# EAGLE design 8eye line sensor (EAGLE 7.1.0)
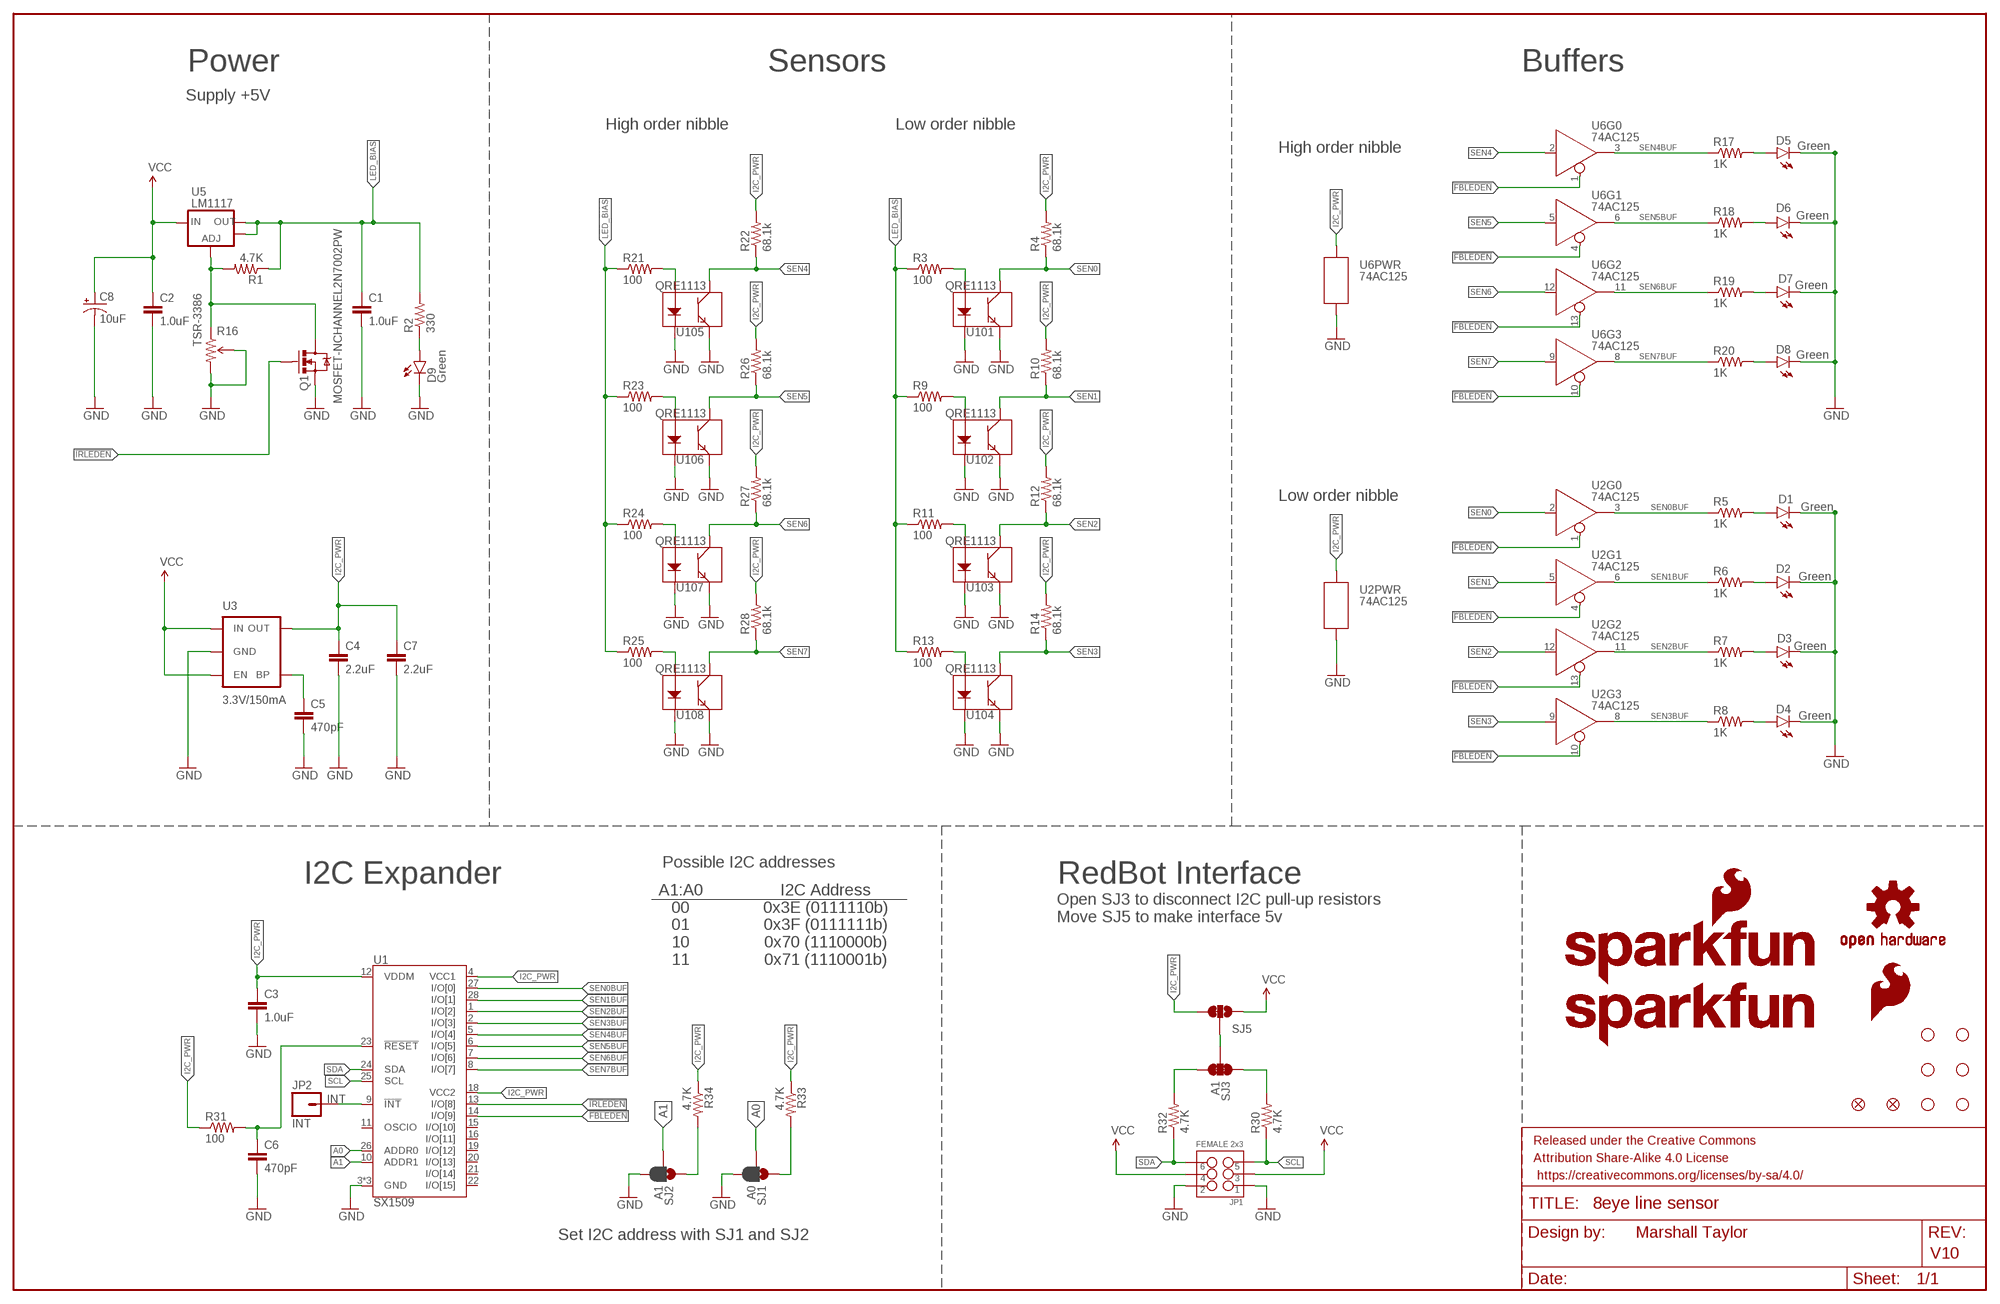
[diagram p0: schematic, sheet 1]

## Parts
C1  1.0uF  1.0UF-16V-10%(0603)  [0603-CAP]
C2  1.0uF  1.0UF-16V-10%(0603)  [0603-CAP]
C3  1.0uF  1.0UF-16V-10%(0603)  [0603-CAP]
C4  2.2uF  2.2UF-10V-20%(0603)  [0603-CAP]
C5  470pF  470PF-50V-5%(0603)SMD  [0603-CAP]
C6  470pF  470PF-50V-5%(0603)SMD  [0603-CAP]
C7  2.2uF  2.2UF-10V-20%(0603)  [0603-CAP]
C8  10uF  10UF-16V-10%(TANT)  [EIA3216]
D1  Green  LED-GREEN1206-BOTTOM  [LED-1206-BOTTOM]
D2  Green  LED-GREEN1206-BOTTOM  [LED-1206-BOTTOM]
D3  Green  LED-GREEN1206-BOTTOM  [LED-1206-BOTTOM]
D4  Green  LED-GREEN1206-BOTTOM  [LED-1206-BOTTOM]
D5  Green  LED-GREEN1206-BOTTOM  [LED-1206-BOTTOM]
D6  Green  LED-GREEN1206-BOTTOM  [LED-1206-BOTTOM]
D7  Green  LED-GREEN1206-BOTTOM  [LED-1206-BOTTOM]
D8  Green  LED-GREEN1206-BOTTOM  [LED-1206-BOTTOM]
D9  Green  LED-GREEN1206-BOTTOM  [LED-1206-BOTTOM]
FID1  FIDUCIALUFIDUCIAL  [MICRO-FIDUCIAL]
FID2  FIDUCIALUFIDUCIAL  [MICRO-FIDUCIAL]
FRAME2  FRAME-LEDGER  [CREATIVE_COMMONS]
JP1  FEMALE 2x3  M03X2FEMALE  [2X3]
JP2  INT  M01PTH  [1X01]
LOGO1  SFE_LOGO_NAME_FLAME.2_INCH  [SFE_LOGO_NAME_FLAME_.2]
LOGO2  SFE_LOGO_NAME.2_INCH  [SFE_LOGO_NAME_.2]
LOGO5  SFE_LOGO_FLAME.3_INCH  [SFE_LOGO_FLAME_.3]
LOGO6  OSHW-LOGOS  [OSHW-LOGO-S]
Q1  MOSFET-NCHANNEL2N7002PW  [SOT323]
R1  4.7K  4.7KOHM-1/10W-1%(0603)  [0603-RES]
R2  330  330OHM1/10W1%(0603)  [0603-RES]
R3  100  100OHM-1/10W-1%(0603)  [0603-RES]
R4  68.1k  68.1KOHM1/10W1%(0603)  [0603-RES]
R5  1K  1KOHM-1/10W-1%(0603)  [0603-RES]
R6  1K  1KOHM-1/10W-1%(0603)  [0603-RES]
R7  1K  1KOHM-1/10W-1%(0603)  [0603-RES]
R8  1K  1KOHM-1/10W-1%(0603)  [0603-RES]
R9  100  100OHM-1/10W-1%(0603)  [0603-RES]
R10  68.1k  68.1KOHM1/10W1%(0603)  [0603-RES]
R11  100  100OHM-1/10W-1%(0603)  [0603-RES]
R12  68.1k  68.1KOHM1/10W1%(0603)  [0603-RES]
R13  100  100OHM-1/10W-1%(0603)  [0603-RES]
R14  68.1k  68.1KOHM1/10W1%(0603)  [0603-RES]
R16  TSR-3386  TRIMPOT-PTH-KNOB  [3386U]
R17  1K  1KOHM-1/10W-1%(0603)  [0603-RES]
R18  1K  1KOHM-1/10W-1%(0603)  [0603-RES]
R19  1K  1KOHM-1/10W-1%(0603)  [0603-RES]
R20  1K  1KOHM-1/10W-1%(0603)  [0603-RES]
R21  100  100OHM-1/10W-1%(0603)  [0603-RES]
R22  68.1k  68.1KOHM1/10W1%(0603)  [0603-RES]
R23  100  100OHM-1/10W-1%(0603)  [0603-RES]
R24  100  100OHM-1/10W-1%(0603)  [0603-RES]
R25  100  100OHM-1/10W-1%(0603)  [0603-RES]
R26  68.1k  68.1KOHM1/10W1%(0603)  [0603-RES]
R27  68.1k  68.1KOHM1/10W1%(0603)  [0603-RES]
R28  68.1k  68.1KOHM1/10W1%(0603)  [0603-RES]
R30  4.7K  4.7KOHM-1/10W-1%(0603)  [0603-RES]
R31  100  100OHM-1/10W-1%(0603)  [0603-RES]
R32  4.7K  4.7KOHM-1/10W-1%(0603)  [0603-RES]
R33  4.7K  4.7KOHM-1/10W-1%(0603)  [0603-RES]
R34  4.7K  4.7KOHM-1/10W-1%(0603)  [0603-RES]
SJ1  A0  JUMPER-PAD-3-2OF3_NC_BY_PASTE  [PAD-JUMPER-3-2OF3_NC_BY_PASTE_YES_SILK_FULL_BOX]
SJ2  A1  JUMPER-PAD-3-2OF3_NC_BY_PASTE  [PAD-JUMPER-3-2OF3_NC_BY_PASTE_YES_SILK_FULL_BOX]
SJ3  A1  JUMPER-PAD-3-NC_BY_TRACE  [PAD-JUMPER-3-3OF3_NC_BY_TRACE_YES_SILK_FULL_BOX]
SJ5  JUMPER-PAD-3-2OF3_NC_BY_TRACE_SMALL  [PAD-JUMPER-3-2OF3_NC_BY_TRACE_YES_SILK_FULL_BOX]
STANDOFF1  STAND-OFF  [STAND-OFF]
STANDOFF2  STAND-OFF  [STAND-OFF]
STANDOFF3  STAND-OFF  [STAND-OFF]
STANDOFF4  STAND-OFF  [STAND-OFF]
STANDOFF5  STAND-OFF  [STAND-OFF]
STANDOFF6  STAND-OFF  [STAND-OFF]
U1  SX1509  [QFN-28]
U2  74AC125  74AC125DG125  [SO14]
U3  3.3V/150mA  V_REG_MIC52053.3V  [SOT23-5]
U5  LM1117  V_REG_LM1117SOT223  [SOT223]
U6  74AC125  74AC125DG125  [SO14]
U101  QRE1113  [QRE1113]
U102  QRE1113  [QRE1113]
U103  QRE1113  [QRE1113]
U104  QRE1113  [QRE1113]
U105  QRE1113  [QRE1113]
U106  QRE1113  [QRE1113]
U107  QRE1113  [QRE1113]
U108  QRE1113  [QRE1113]

## Nets
!FBLEDEN: U1.14(I/O[9]) U2.1(!EN) U2.4(!EN) U2.10(!EN) U2.13(!EN) U6.1(!EN) U6.4(!EN) U6.10(!EN) U6.13(!EN)
!IRLEDEN: Q1.1(G) U1.13(I/O[8])
A0: SJ1.2 U1.26(ADDR0)
A1: SJ2.2 U1.10(ADDR1)
GND: C1.2 C2.2 C3.2 C4.2 C5.2 C6.2 C7.2 C8.C(-) D1.C D2.C D3.C D4.C D5.C D6.C D7.C D8.C D9.C JP1.1 JP1.2 Q1.2(S) R16.2(WIPER) R16.3(CW) SJ1.3 SJ2.3 U1.3(GND) U1.17(GND) U1.29(GND) U2.7(PWR:P$V-) U3.2(GND) U6.7(PWR:P$V-) U101.2(K) U101.4(E) U102.2(K) U102.4(E) U103.2(K) U103.4(E) U104.2(K) U104.4(E) U105.2(K) U105.4(E) U106.2(K) U106.4(E) U107.2(K) U107.4(E) U108.2(K) U108.4(E)
I2C_PWR: C3.1 C4.1 C7.1 R4.2 R10.2 R12.2 R14.2 R22.2 R26.2 R27.2 R28.2 R31.1 R33.1 R34.1 SJ5.3 U1.4(VCC1) U1.12(VDDM) U1.18(VCC2) U2.14(PWR:P$V+) U3.5(OUT) U6.14(PWR:P$V+)
INT: JP2.1 U1.9(!INT)
LED_BIAS: C1.1 R1.1 R2.2 R3.1 R9.1 R11.1 R13.1 R21.1 R23.1 R24.1 R25.1 U5.2(OUT) U5.4(OUT)
N$1: Q1.3(D) R1.2 R16.1(CCW) U5.1(ADJ)
N$2: R3.2 U101.1(A)
N$3: R21.2 U105.1(A)
N$4: R30.2 SJ3.1
N$5: D1.A R5.2
N$6: C5.1 U3.4(BP)
N$7: D2.A R6.2
N$8: R32.2 SJ3.3
N$9: D3.A R7.2
N$10: R34.2 SJ2.1
N$11: D4.A R8.2
N$12: R9.2 U102.1(A)
N$13: R23.2 U106.1(A)
N$14: R11.2 U103.1(A)
N$15: R24.2 U107.1(A)
N$16: R13.2 U104.1(A)
N$17: R25.2 U108.1(A)
N$18: D9.A R2.1
N$19: SJ3.2 SJ5.2
N$20: D5.A R17.2
N$21: R33.2 SJ1.1
N$22: D6.A R18.2
N$24: D7.A R19.2
N$26: D8.A R20.2
SCL: JP1.5 R30.1 U1.25(SCL)
SDA: JP1.6 R32.1 U1.24(SDA)
SEN0: R4.1 U2.2(D) U101.3(C)
SEN0BUF: R5.1 U1.27(I/O[0]) U2.3(Q)
SEN1: R10.1 U2.5(D) U102.3(C)
SEN1BUF: R6.1 U1.28(I/O[1]) U2.6(Q)
SEN2: R12.1 U2.12(D) U103.3(C)
SEN2BUF: R7.1 U1.1(I/O[2]) U2.11(Q)
SEN3: R14.1 U2.9(D) U104.3(C)
SEN3BUF: R8.1 U1.2(I/O[3]) U2.8(Q)
SEN4: R22.1 U6.2(D) U105.3(C)
SEN4BUF: R17.1 U1.5(I/O[4]) U6.3(Q)
SEN5: R26.1 U6.5(D) U106.3(C)
SEN5BUF: R18.1 U1.6(I/O[5]) U6.6(Q)
SEN6: R27.1 U6.12(D) U107.3(C)
SEN6BUF: R19.1 U1.7(I/O[6]) U6.11(Q)
SEN7: R28.1 U6.9(D) U108.3(C)
SEN7BUF: R20.1 U1.8(I/O[7]) U6.8(Q)
VCC: C2.1 C8.A(+) JP1.3 JP1.4 SJ5.1 U3.1(IN) U3.3(EN) U5.3(IN)
~RESET: C6.1 R31.2 U1.23(!RESET)
Unconnected: U1.11(OSCIO) U1.15(I/O[10]) U1.16(I/O[11]) U1.19(I/O[12]) U1.20(I/O[13]) U1.21(I/O[14]) U1.22(I/O[15])

## Notes on the sheet
- Power | Sensors | Buffers
- Supply +5V
- High order nibble | Low order nibble
- High order nibble
- Low order nibble
- Possible I2C addresses
- I2C Expander
- A1:A0
  00
  01
  10
  11
- I2C Address
  0x3E (0111110b)
  0x3F (0111111b)
  0x70 (1110000b)
  0x71 (1110001b)
- RedBot Interface
- Open SJ3 to disconnect I2C pull-up resistors
  Move SJ5 to make interface 5v
- Set I2C address with SJ1 and SJ2 | Marshall Taylor
- V10

## Library data of the parts
C1-C3 = SparkFun-Capacitors:1.0UF-16V-10%(0603): CAP-00868; PROD_ID: CAP-00868
C4 C7 = SparkFun-Capacitors:2.2UF-10V-20%(0603): CAP-07888; PROD_ID: CAP-07888
C5 C6 = SparkFun-Capacitors:470PF-50V-5%(0603): CAP-07884; PROD_ID: CAP-07884
C8 = SparkFun-Capacitors:10UF-16V-10%(TANT): CAP-00811 1206/EIA-3216 Tantalum capacitor; PROD_ID: CAP-00811
D1-D9 = SparkFun-LED:LED-GREEN: Various green LEDs Green LEDs used in SFE Production 0603- DIO-00821 LARGE- DIO-00862 LILYPAD- DIO-09910; PROD_ID: DIO-11076
FID1 FID2 = SparkFun-Aesthetics:FIDUCIAL: Fiducial Alignment Points Various fiducial points for machine vision alignment.
FRAME2 = SparkFun-Aesthetics:FRAME-LEDGER: Schematic Frame Standard 11x14 US Ledger frame
JP1 = SparkFun-Connectors:M03X2: 2x3 .1" header. Shrouded, with keying- CONN-10681 SMT- CONN-11415 Pogo pins- HW-11044; PROD_ID: CONN-11566
JP2 = SparkFun-Connectors:M01: Header 1 Standard 1-pin 0.1" header. Use with straight break away headers (SKU : PRT-00116), right angle break away headers (PRT-00553), swiss pins (PRT-00743), machine pins (PRT-00117), and female headers (PRT-00115).
LOGO1 = SparkFun-Aesthetics:SFE_LOGO_NAME_FLAME: SFE Logo, name and flame This is the SparkFun full logo. The logo on the schematic will always be the same size; the package variant is the height of the flame part of the logo. Default layer for the logo on the board is tSilk.
LOGO2 = SparkFun-Aesthetics:SFE_LOGO_NAME: SFE Logo, name only This is the SparkFun name logo. The logo on the schematic will always be the same size; the package variant is the height of the flame part of the logo (or the height the flame would be, if it were drawn). Default layer for the logo on the board is tSilk.
LOGO5 = SparkFun-Aesthetics:SFE_LOGO_FLAME: SFE Logo, flame only This is the SparkFun flame logo. The logo on the schematic will always be the same size; the package variant is the height of the flame. Default layer for the logo on the board is tSilk.
LOGO6 = SparkFun-Aesthetics:OSHW-LOGO: Open Source Hardware Logo This logo indicates the piece of hardware it is found on incorporates a OSHW license and/or adheres to the definition of open source hardware found here: http://freedomdefined.org/OSHW
Q1 = SparkFun-DiscreteSemi:MOSFET-NCHANNEL: Common NMOSFET Parts MFG P/N Store ID Prod ID FDD8780 TRANS-09984 SI7820DN TRANS-11055 FDS6630A IC-08089 2N7002PW TRANS-11151 FQP30N06L COM-10213 TRANS-10060 BSS123LT1G TRANS-08345 BSS138 TRANS-00830 BS170 2N7000; PROD_ID: TRANS-11151
R1 R30 R32-R34 = SparkFun-Resistors:4.7KOHM-1/10W-1%(0603): RES-07857; PROD_ID: RES-07857
R2 = SparkFun-Resistors:330OHM1/10W1%(0603): RES-00818; PROD_ID: RES-00818
R3 R9 R11 R13 R21 R23-R25 R31 = SparkFun-Resistors:100OHM-1/10W-1%(0603): RES-07863; PROD_ID: RES-07863
R4 R10 R12 R14 R22 R26-R28 = SparkFun-Resistors:68.1KOHM1/10W1%(0603): RES-09380; PROD_ID: RES-09380
R5-R8 R17-R20 = SparkFun-Resistors:1KOHM-1/10W-1%(0603): RES-07856; PROD_ID: RES-07856
R16 = SparkFun-Electromechanical:TRIMPOT: Various small potentiometers for "set-and-forget" applications; PROD_ID: RES-09730
SJ1 SJ2 = SparkFun-Passives:JUMPER-PAD-3-2OF3_NC_BY_PASTE
SJ3 = SparkFun-Passives:JUMPER-PAD-3-NC_BY_TRACE
SJ5 = SparkFun-Passives:JUMPER-PAD-3-2OF3_NC_BY_TRACE
STANDOFF1-STANDOFF6 = SparkFun-Electromechanical:STAND-OFF: #4 Stand Off This is the mechanical footprint for a #4 phillips button head screw. Use the keepout ring to avoid running the screw head into surrounding components. SKU : PRT-00447
U1 = SparkFun-DigitalIC:SX1509: Semtech SX1509 The SX1509 is a complete ultra low voltage 1.2V to 3.6V General Purpose parallel Input/Output (GPIO) expanders ideal for low power handheld battery powered equipment. This version comes in a 16-channel configuration and allows easy serial expansion of I/O through a standard 400kHz I2C interface. GPIO devices can provide additional control and monitoring when the microcontroller or chipset has insufficient I/O ports, or in systems where serial communication and control from a remote location is advantageous.; PROD_ID: IC-11311
U2 U6 = SparkFun-DigitalIC:74*125; PROD_ID: IC-08880
U3 = SparkFun-PowerIC:V_REG_MIC5205: V_REG MIC5205 Standard 3.3V, 5V, and Adjustable 150mA LDO voltage regulator in SOT-23 layout. Micrel part MIC5205. BP (by-pass) pin is used to lower output noise with 470pF cap, may be left open. On the adjustable version BP is used to set output.; PROD_ID: VREG-00822
U5 = SparkFun-PowerIC:V_REG_LM1117: Voltage Regulator LM1117 Standard adjustable voltage regulator but in SMD form. Spark Fun Electronics SKU : COM-00595; PROD_ID: VREG-08170
U101-U108 = SparkFun-Sensors:QRE1113: Reflective object sensor; PROD_ID: IC-09357

## Net classes
0 default: clearance 0.305 mm

## Board
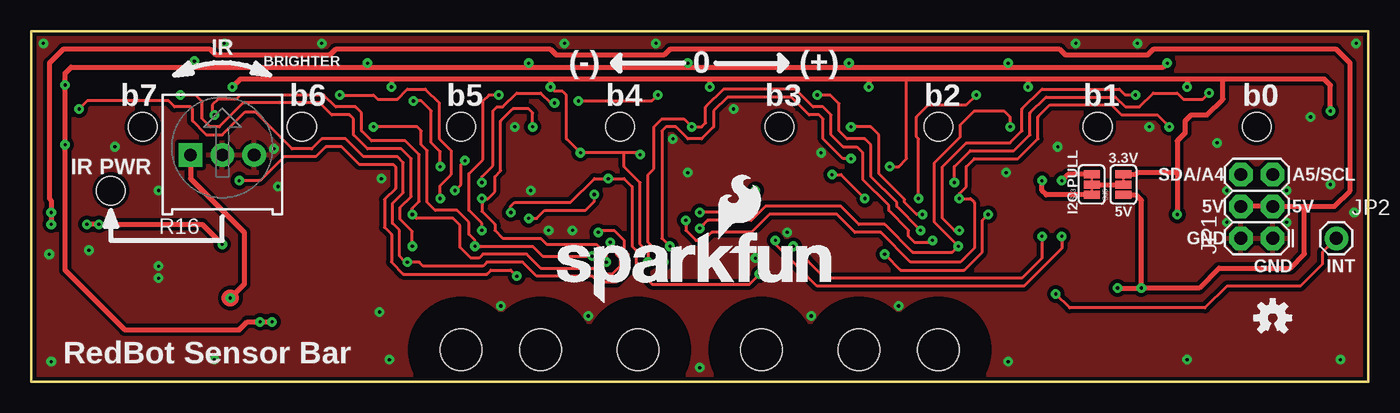
[diagram p1: board, top side]
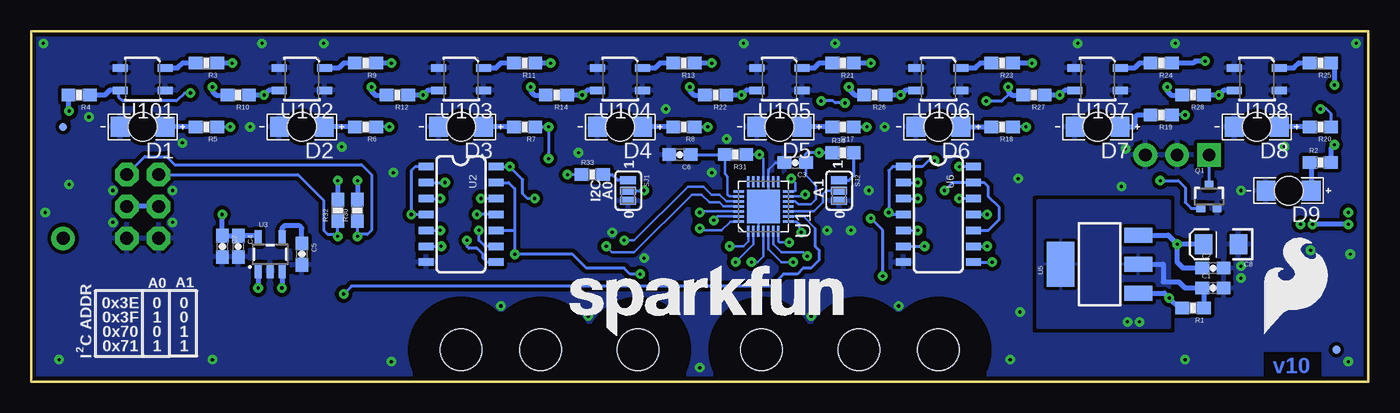
[diagram p2: board, bottom side, seen from below]

Size 106.68 x 27.94 mm. Coordinates in mm from the lower left corner, seen from the top.
Outline: 0,0 106.68,0 106.68,27.94 0,27.94 0,0
Copper layers (1*16): Top 0.035mm / dielectric 1.5mm / Bottom 0.035mm
Design rules "SparkFun-2-layer *": minimum track width 7mil, minimum drill 15mil, track to track 7mil, track to pad 7mil, pad to pad 7mil, via to via 7mil, smd to smd 7mil, copper to edge 8mil, drill to drill 8mil, minimum pad ring 12mil, minimum via ring 10mil, stop-mask expansion 4mil, vias tented up to drill 20mil, thermal gap 10mil
tRestrict: area 68.7,-1.2 to 76.1,6.2; area 62.3,-1.2 to 69.7,6.2; area 54.6,-1.2 to 62,6.2; area 44.7,-1.2 to 52.1,6.2; area 36.9,-1.2 to 44.3,6.2; area 30.6,-1.2 to 38,6.2
bRestrict: area 30.6,-1.2 to 38,6.2; area 36.9,-1.2 to 44.3,6.2; area 44.7,-1.2 to 52.1,6.2; area 54.6,-1.2 to 62,6.2; area 62.3,-1.2 to 69.7,6.2; area 68.7,-1.2 to 76.1,6.2

### Footprints (pad centres in the part's own frame; a part is rotated, then mirrored left to right if it is on the bottom)
0603-CAP = smd 1.1 x 1: 1 -0.85,0; 2 0.85,0
EIA3216 = smd 1.4 x 1.6: A 1.4,0; C -1.4,0
LED-1206-BOTTOM = smd 1.5 x 1.6: A -1.8,0; C 1.8,0 | hole 2.3: 0,0
MICRO-FIDUCIAL = smd 0.635 x 0.635: 1 0,0
2X3 = drill 1.016 pad 1.88 octagon: 1 0,0; 2 0,2.54; 3 2.54,0; 4 2.54,2.54; 5 5.08,0; 6 5.08,2.54
1X01 = drill 1.016 pad 1.88: 1 0,0
SOT323 = smd 0.7 x 0.7: 1 -0.65,-0.925; 2 0.65,-0.925; 3 0,0.925
0603-RES = smd 1.1 x 1: 1 -0.85,0; 2 0.85,0
3386U = drill 1.016 pad 1.88 square: 1 -2.54,-0.015 | drill 1.016 pad 1.88: 2 0,-0.015; 3 2.54,-0.015
PAD-JUMPER-3-2OF3_NC_BY_PASTE_YES_SILK_FULL_BOX = smd 0.635 x 1.27: 1 -0.813,0; 2 0,0; 3 0.813,0
PAD-JUMPER-3-3OF3_NC_BY_TRACE_YES_SILK_FULL_BOX = smd 0.635 x 1.27: 1 -0.813,0; 2 0,0; 3 0.813,0
PAD-JUMPER-3-2OF3_NC_BY_TRACE_YES_SILK_FULL_BOX = smd 0.635 x 1.27: 1 -0.813,0; 2 0,0; 3 0.813,0
STAND-OFF = hole 3.302: 0,0
QFN-28 = smd 0.85 x 0.2: 1 -1.975,1.2; 2 -1.975,0.8; 3 -1.975,0.4; 4 -1.975,0; 5 -1.975,-0.4; 6 -1.975,-0.8; 7 -1.975,-1.2; 15 1.975,-1.2; 16 1.975,-0.8; 17 1.975,-0.4; 18 1.975,0; 19 1.975,0.4; 20 1.975,0.8; 21 1.975,1.2 | smd 0.2 x 0.85: 8 -1.2,-1.975; 9 -0.8,-1.975; 10 -0.4,-1.975; 11 0,-1.975; 12 0.4,-1.975; 13 0.8,-1.975; 14 1.2,-1.975; 22 1.2,1.975; 23 0.8,1.975; 24 0.4,1.975; 25 0,1.975; 26 -0.4,1.975; 27 -0.8,1.975; 28 -1.2,1.975 | smd 2.65 x 2.65: 29 0,0
SO14 = smd 0.6 x 1.2: 1 -3.81,-2.8; 2 -2.54,-2.8; 3 -1.27,-2.8; 4 0,-2.8; 5 1.27,-2.8; 6 2.54,-2.8; 7 3.81,-2.8; 8 3.81,2.8; 9 2.54,2.8; 10 1.27,2.8; 11 0,2.8; 12 -1.27,2.8; 13 -2.54,2.8; 14 -3.81,2.8
SOT23-5 = smd 0.55 x 1.2: 1 -0.95,-1.3; 2 0,-1.3; 3 0.95,-1.3; 4 0.95,1.3; 5 -0.95,1.3
SOT223 = smd 1.219 x 2.235: 1 -2.311,-3.099; 2 0,-3.099; 3 2.311,-3.099 | smd 3.6 x 2.2: 4 0,3.099
QRE1113 = smd 1.2 x 0.6: 1 -1.8,-0.9; 2 1.8,-0.9; 3 1.8,0.9; 4 -1.8,0.9

### Placement (x,y rotation side)
C1  12.38,7.46 0 bottom
C2  12.38,9.05 0 bottom
C3  45.72,17.46 180 bottom
C4  90.17,10.79 270 bottom
C5  85.09,10.16 270 bottom
C6  54.93,18.1 180 bottom
C7  91.44,10.79 270 bottom
C8  11.75,10.95 180 bottom
D1  97.79,20.32 180 bottom
D2  85.09,20.32 180 bottom
D3  72.39,20.32 180 bottom
D4  59.69,20.32 180 bottom
D5  46.99,20.32 180 bottom
D6  34.29,20.32 180 bottom
D7  21.59,20.32 180 bottom
D8  8.89,20.32 180 bottom
D9  6.35,15.24 180 bottom
FID1  2.54,2.54 0 bottom
FID2  104.14,20.32 0 bottom
FRAME2  5.08,-33.02 0 top  (outside the outline)
JP1  99.06,11.43 90 top
JP2  104.14,11.43 0 top
LOGO1  41.27,6.19 0 top
LOGO2  63.69,3.64 0 bottom
LOGO5  8.81,3.68 0 bottom
LOGO6  99.06,5.08 0 top
Q1  12.7,14.76 0 bottom
R1  13.97,5.87 180 bottom
R2  3.81,17.46 0 bottom
R3  92.71,25.4 180 bottom
R4  102.87,22.86 180 bottom
R5  92.71,20.32 180 bottom
R6  80.01,20.32 180 bottom
R7  67.31,20.32 180 bottom
R8  54.61,20.32 180 bottom
R9  80.01,25.4 180 bottom
R10  90.17,22.86 180 bottom
R11  67.31,25.4 180 bottom
R12  77.47,22.86 180 bottom
R13  54.61,25.4 180 bottom
R14  64.77,22.86 180 bottom
R16  15.24,18.1 0 top
R17  41.91,20.32 180 bottom
R18  29.21,20.32 180 bottom
R19  16.51,21.27 180 bottom
R20  3.81,20.32 180 bottom
R21  41.91,25.4 180 bottom
R22  52.07,22.86 180 bottom
R23  29.21,25.4 180 bottom
R24  16.51,25.4 180 bottom
R25  3.81,25.4 180 bottom
R26  39.37,22.86 180 bottom
R27  26.67,22.86 180 bottom
R28  13.97,22.86 180 bottom
R30  80.64,13.65 90 bottom
R31  50.48,18.1 180 bottom
R32  82.23,13.65 90 bottom
R33  61.91,16.51 0 bottom
R34  41.91,18.26 0 bottom
SJ1  59.05,15.24 270 bottom
SJ2  42.23,15.24 270 bottom
SJ3  84.61,15.72 90 top
SJ5  87.15,15.72 90 top
STANDOFF1  34.29,2.54 90 top
STANDOFF2  40.64,2.54 90 top
STANDOFF3  48.42,2.54 90 top
STANDOFF4  58.26,2.54 90 top
STANDOFF5  66.04,2.54 90 top
STANDOFF6  72.39,2.54 90 top
U1  48.26,13.97 90 bottom
U2  72.39,13.34 270 bottom
U3  87.63,10.16 0 bottom
U5  21.43,9.37 90 bottom
U6  34.29,13.34 270 bottom
U101  97.79,24.13 180 bottom
U102  85.09,24.13 180 bottom
U103  72.39,24.13 180 bottom
U104  59.69,24.13 180 bottom
U105  46.99,24.13 180 bottom
U106  34.29,24.13 180 bottom
U107  21.59,24.13 180 bottom
U108  8.89,24.13 180 bottom

### Tracks (layer width: path | path; a pad name or v marks a point on that pad's centre or on a via)
!FBLEDEN  (via drill 0.25 pad 0.25)
  Top 0.254: v68.1,10.16 69.37,8.89 74.45,8.89 75.88,10.32 75.88,12.86 v76.36,13.34 | v33.81,15.24 34.29,15.72 34.29,17.3 v34.61,17.62 | v58.1,8.57 57.31,7.78 49.53,7.78 48.26,9.05 48.26,10.48 47.94,10.79 47.94,15.56 47.31,16.19 v46.04,16.19 44.93,16.19 43.02,14.29 38.58,14.29 38.26,13.97 v38.26,13.49
  Bottom 0.203: U1.14 45.79,15.17 45.72,15.24 45.72,15.88 v46.04,16.19
  Bottom 0.254: U2.1 76.04,17.14 76.36,16.83 v76.36,13.34 U2.4 | U2.10 68.1,12.06 | 68.1,12.06 v68.1,10.16 63.5,10.16 62.39,9.05 59.37,9.05 58.9,8.57 v58.1,8.57 | U2.13 68.58,15.88 68.1,15.4 68.1,12.06 | U6.10 30.32,12.06 29.45,12.94 29.45,13.89 30.32,14.76 30.32,15.56 30.64,15.88 U6.13 33.18,15.88 v33.81,15.24 | v34.61,17.62 35.08,17.62 35.56,17.14 U6.1 37.94,17.14 38.26,16.83 v38.26,13.49 38.1,13.34 U6.4
!IRLEDEN  (via drill 0.25 pad 0.25)
  Top 0.254: v16.59,16.03 18.26,16.03 20.16,17.94 22.7,17.94 23.5,18.73 24.77,18.73 26.19,17.3 28.89,17.3 29.05,17.14 29.05,15.4 28.18,14.53 28.18,12.3 28.73,11.75 28.73,9.53 29.69,8.57 36.35,8.57 36.67,8.89 38.26,8.89 v38.73,8.41 | v39.69,13.02 40.32,13.02 40.96,13.65 44.21,13.65 44.93,14.37 v44.93,14.92
  Bottom 0.203: U1.13 45.09,14.77 v44.94,14.92 v44.93,14.92
  Bottom 0.254: v16.59,16.03 15.16,16.03 14.61,15.48 14.61,14.29 14.13,13.81 13.38,13.81 Q1.1 | v38.73,8.41 38.73,12.06 v39.69,13.02
A0  (via drill 0.25 pad 0.25)
  Top 0.254: v57.78,15.24 57.78,14.29 56.99,13.49 v53.34,13.49
  Bottom 0.203: U1.26 53.26,13.57 v53.34,13.49
  Bottom 0.254: SJ1.2 v57.78,15.24
A1
  Bottom 0.203: U1.10 44.22,13.57 43.5,14.29 43.5,15 43.26,15.24 SJ2.2
GND  (via drill 0.25 pad 0.25)
  Bottom 0.203: U1.3 48.66,13.57 U1.29 47.86,14.37 U1.17 47.86,16.9 47.3,17.46 C3.2
  other vias: 95.41,12.7 100.17,12.7 62.23,5.24 69.22,6.03 53.34,1.11 44.45,5.24 37.47,6.03 57.78,9.84 60.33,11.91 0.95,26.99 105.73,26.99 83.34,26.99 88.27,26.99 42.55,26.99 49.85,26.99 15.4,26.99 23.18,26.99 1.43,10.16 4.6,10.48 14.61,1.75 19.68,15.56 27.94,16.19 27.78,5.56 10.16,9.21 10.16,8.26 10.16,15.24 19.37,18.57 6.67,18.73 52.39,16.67 51.2,19.37 56.04,21.75 38.58,20.32 39.85,15.24 77.79,16.67 81.92,18.73 89.22,20.32 102.08,21.11 94.61,19.05 95.41,15.24 100.17,15.24 63.02,18.26 41.27,12.06 43.18,12.06 77.95,1.59 28.57,1.75 92.23,1.75 104.46,1.75 1.59,1.59 103.66,15.72 105.57,13.49
  pour Top (isolate 0.305, rank 2): 106.68,27.94 0,27.94 0,0 106.68,0
  pour Bottom (isolate 0.305, rank 2): 106.68,27.94 0,27.94 0,0 3.49,0 3.49,2.54 8.57,2.54 8.57,0 106.68,0
I2C_PWR  (via drill 0.25 pad 0.25)
  Top 0.254: v32.62,17.14 32.62,18.34 31.91,19.05 31.91,21.59 31.11,22.38 v30.48,22.38 | v68.5,17.14 69.22,17.14 69.85,17.78 69.85,24.13 | v48.58,18.1 48.42,18.26 47.31,18.26 | 47.31,18.26 v43.81,18.26 42.7,19.37 42.7,22.86 42.39,23.18 41.75,23.18 v41.43,23.5 | v63.9,16.51 64.61,16.51 v66.52,14.61 | 47.31,18.26 47.31,17.14 48.58,15.88 48.58,10.95 49.21,10.32 v49.21,9.53
  Top 0.406: v103.66,21.59 103.66,23.65 103.19,24.13 95.09,24.13 | 95.09,24.13 92.23,24.13 | 92.23,24.13 79.53,24.13 | 79.53,24.13 69.85,24.13 66.83,24.13 | 66.83,24.13 54.13,24.13 | 54.13,24.13 41.43,24.13 | 41.43,24.13 28.73,24.13 | 28.73,24.13 16.67,24.13 v16.03,23.5 | 92.23,24.13 v92.23,23.5 | 79.53,24.13 v79.53,23.5 | 66.83,24.13 v66.83,23.5 | 54.13,24.13 v54.13,23.5 | 41.43,24.13 v41.43,23.5 | 28.73,24.13 v28.73,23.5 | 95.09,24.13 95.09,22.54 93.82,21.27 92.55,21.27 92.08,20.8 92.08,19.84 91.44,19.21 91.44,16.67 | 91.44,16.67 v91.44,13.34 | 91.44,16.67 88.27,16.67 88.12,16.53 SJ5.3
  Bottom 0.203: 44.93,17.52 C3.1 44.87,16.45 44.05,15.64 44.05,14.53 44.45,14.13 45.48,14.13 45.72,14.37 U1.12 | U1.18 48.26,17.78 v48.58,18.1 R31.1 | U1.4 48.26,10 48.74,9.53 v49.21,9.53
  Bottom 0.254: U6.14 v32.62,17.14 | v30.48,22.38 29.21,22.38 28.57,23.02 | U2.14 v68.5,17.14 67.47,16.11 67.47,15 67.07,14.61 v66.52,14.61 | R34.1 v43.81,18.26 44.77,18.26 44.93,18.1 44.93,17.52 | R33.1 v63.9,16.51
  Bottom 0.406: U3.5 88.77,11.64 C4.1 C7.1 v91.44,13.34 | R4.2 103.72,21.65 v103.66,21.59 | v92.23,23.5 92.23,23.18 91.92,22.86 R10.2 | v79.53,23.5 79.53,23.18 79.22,22.86 R12.2 | v66.83,23.5 66.83,23.18 66.52,22.86 R14.2 | v54.13,23.5 54.13,23.18 53.82,22.86 R22.2 | v41.43,23.5 41.43,23.34 40.96,22.86 R26.2 | v28.73,23.5 28.73,23.18 28.57,23.02 28.42,22.86 R27.2 | v16.03,23.5 16.03,23.18 15.72,22.86 R28.2
INT  (via drill 0.25 pad 0.25)
  Top 0.254: JP2.1 103.03,10.32 103.03,9.37 101.28,7.62 95.41,7.62 93.66,5.87 82.87,5.87 v81.76,6.99
  Bottom 0.203: U1.9 45.08,13.17 44.13,12.22
  Bottom 0.254: 44.13,12.22 44.13,10.79 43.81,10.48 43.81,9.68 44.45,9.05 45.09,9.05 45.56,8.57 46.67,8.57 47.62,7.62 81.12,7.62 v81.76,6.99
LED_BIAS  (via drill 0.25 pad 0.25)
  Top 0.406: 13.02,25.08 3.17,25.08 2.7,24.61 v2.7,23.65 v2.7,18.89 2.7,8.89 7.46,4.13 16.59,4.13 17.22,4.76 v19.21,4.76 | 13.02,25.08 26.83,25.08 | 26.83,25.08 39.69,25.08 | 39.69,25.08 52.39,25.08 | 52.39,25.08 65.25,25.08 | 65.25,25.08 77.95,25.08 | 77.95,25.08 90.33,25.08 v90.65,25.4 | 13.02,25.08 v13.02,25.56 | 26.83,25.08 v26.83,25.4 | 39.69,25.08 v39.69,25.4 | 52.39,25.08 v52.39,25.4 | 65.25,25.08 v65.25,25.4 | 77.95,25.08 v77.95,25.4
  Bottom 0.406: R2.2 2.96,18.63 v2.7,18.89 | R25.1 2.7,25.14 v2.7,23.65 | v13.02,25.56 13.81,25.56 13.97,25.4 R24.1 | v26.83,25.4 R23.1 | v39.69,25.4 R21.1 | v52.39,25.4 R13.1 | v65.25,25.4 R11.1 | v77.95,25.4 R9.1 | v90.65,25.4 R3.1 | U5.2 16.35,9.37 16.35,7.94 15.08,7.94 14.61,7.46 C1.1 13.12,7.35 R1.1
  other vias: 18.26,4.76
  pour Bottom (isolate 0.305): 15.88,4.29 26.35,4.29 26.35,14.45 15.88,14.45
N$1  (via drill 0.25 pad 0.25)
  Top 0.406: R16.1 12.7,16.19 16.99,11.91 16.99,7.78 v15.88,6.67
  Bottom 0.254: R16.1 Q1.3
  Bottom 0.406: U5.1 16.26,7.05 v15.88,6.67 15.08,5.87 R1.2
N$2
  Bottom 0.406: R3.2 94.61,25.4 94.98,25.03 U101.1
N$3
  Bottom 0.406: R21.2 43.81,25.4 44.19,25.03 U105.1
N$4  (via drill 0.25 pad 0.25)
  Top 0.406: SJ3.1 80.98,14.9 80.64,15.24 v80.64,16.03
  Bottom 0.406: v80.64,16.03 R30.2
N$5
  Bottom 0.406: R5.2 D1.A
N$6
  Bottom 0.406: U3.4 86.68,12.22 86.44,12.46 85.33,12.46 85.09,12.22 C5.1
N$7
  Bottom 0.406: R6.2 D2.A
N$8  (via drill 0.25 pad 0.25)
  Top 0.406: SJ3.3 82.73,16.53 v82.23,16.03
  Bottom 0.406: v82.23,16.03 R32.2
N$9
  Bottom 0.406: R7.2 D3.A
N$10
  Bottom 0.254: R34.2 41.06,16.41 41.41,16.05 SJ2.1
N$11
  Bottom 0.406: R8.2 D4.A
N$12
  Bottom 0.406: R9.2 81.76,25.4 82.13,25.03 U102.1
N$13
  Bottom 0.406: R23.2 30.96,25.4 31.33,25.03 U106.1
N$14
  Bottom 0.406: R11.2 69.22,25.4 69.58,25.03 U103.1
N$15
  Bottom 0.406: R24.2 18.26,25.4 18.63,25.03 U107.1
N$16
  Bottom 0.406: R13.2 56.52,25.4 56.88,25.03 U104.1
N$17
  Bottom 0.406: R25.2 5.56,25.4 5.93,25.03 U108.1
N$18
  Bottom 0.406: R2.1 4.55,17.35 D9.A
N$19
  Top 0.406: SJ3.2 SJ5.2
N$20
  Bottom 0.406: R17.2 D5.A
N$21
  Bottom 0.254: R33.2 60.33,16.51 59.87,16.05 SJ1.1
N$22
  Bottom 0.406: D6.A R18.2
N$24
  Bottom 0.406: D7.A 18.73,20.32 18.57,20.48 18.57,21.11 18.41,21.27 R19.2
N$26
  Bottom 0.406: R20.2 D8.A
SCL  (via drill 0.25 pad 0.25)
  Top 0.254: v80.64,11.59 80.64,9.84 79.06,8.26 63.34,8.26 v60.8,10.79
  Bottom 0.203: U1.25 51.44,13.97 51.75,14.29 52.55,14.29 53.18,14.92 53.98,14.92 58.58,10.32 60.33,10.32 v60.8,10.79
  Bottom 0.254: JP1.5 97.63,17.94 95.89,17.94 95.25,17.3 80.33,17.3 79.53,16.51 79.53,12.06 79.85,11.75 80.49,11.75 | 80.49,11.75 80.64,11.91 R30.1 | 80.49,11.75 v80.64,11.59
SDA  (via drill 0.25 pad 0.25)
  Top 0.254: v82.23,11.59 82.23,10.64 79.22,7.62 62.71,7.62 59.37,10.95 v59.37,11.27
  Bottom 0.203: U1.24 51.2,14.37 51.75,14.92 52.39,14.92 53.02,15.56 54.29,15.56 58.58,11.27 v59.37,11.27
  Bottom 0.254: JP1.6 85.41,16.51 83.34,14.45 83.34,12.06 83.03,11.75 82.39,11.75 82.23,11.91 | 82.23,11.91 R32.1 | 82.23,11.91 v82.23,11.59
SEN0  (via drill 0.25 pad 0.25)
  Top 0.254: v73.66,15.88 73.66,17.14 74.93,18.41 78.42,18.41 79.69,19.68 79.69,21.43 80.96,22.7 86.52,22.7 87.31,21.91 88.42,21.91 89.53,23.02 91.44,23.02 91.92,22.54 93.5,22.54 v93.98,23.02
  Bottom 0.254: U2.2 v73.66,15.88 | v93.98,23.02 94.46,23.02 95.09,22.38 99.38,22.38 99.69,22.7 99.69,23.12 U101.3
  Bottom 0.406: U101.3 100.44,23.23 100.81,22.86 R4.1
SEN0BUF  (via drill 0.25 pad 0.25)
  Top 0.254: v90.81,20.32 89.85,21.27 87,21.27 86.2,22.07 81.28,22.07 80.33,21.11 80.33,19.37 78.74,17.78 75.25,17.78 74.61,17.14 74.61,15.56 74.06,15 v74.06,14.61 74.93,14.61 75.25,14.29 75.25,10.64 74.14,9.53 70.17,9.53 67.79,11.91 65.72,11.91 64.29,13.34 58.9,13.34 57.47,11.91 54.29,11.91 53.66,11.27 53.02,11.27 52.23,12.06 v52.23,12.86
  Bottom 0.203: U1.27 51.92,13.17 v52.23,12.86
  Bottom 0.254: U2.3 v74.06,14.61 | R5.1 v90.81,20.32
SEN1  (via drill 0.25 pad 0.25)
  Top 0.254: v88.11,22.86 87.31,22.86 86.84,23.34 80.64,23.34 79.06,21.75 79.06,20 78.11,19.05 74.61,19.05 72.71,17.14 72.71,13.02 73.66,12.06 v74.06,12.06
  Bottom 0.254: U2.5 v74.06,12.06
  Bottom 0.406: U102.3 87.74,23.23 v88.11,22.86 R10.1
SEN1BUF  (via drill 0.25 pad 0.25)
  Top 0.254: v78.11,20.32 78.11,21.11 77.63,21.59 75.25,21.59 74.14,20.48 74.14,19.53 72.07,17.46 72.07,12.7 v73.98,10.79 73.5,10.32 70.33,10.32 68.1,12.54 66.04,12.54 64.61,13.97 58.58,13.97 57.47,12.86 53.98,12.86 v53.34,12.22 53.66,12.54
  Bottom 0.203: U1.28 50.89,12.77 51.59,12.06 53.18,12.06 v53.34,12.22
  Bottom 0.254: U2.6 v73.98,10.79 | v78.11,20.32 R6.1
SEN2  (via drill 0.25 pad 0.25)
  Top 0.254: v70.8,14.61 70.8,19.37 70.64,19.53 70.64,21.11 71.6,22.07 74.61,22.07 v75.41,22.86
  Bottom 0.254: U2.12 v70.8,14.61
  Bottom 0.406: U103.3 75.04,23.23 v75.41,22.86 R12.1
SEN2BUF  (via drill 0.25 pad 0.25)
  Top 0.254: v71.12,13.34 70.64,13.34 69.69,14.29 69.69,14.53 67.63,16.59 67.63,19.68 66.99,20.32 v65.41,20.32 | v65.41,17.78 64.77,17.78 63.18,19.37 63.18,20.95 62.87,21.27 62.07,21.27 60.64,22.7 55.56,22.7 54.45,21.59 54.45,20.32 53.5,19.37 52.39,19.37 51.44,20.32 50.64,20.32 50.32,20 50.32,11.43 v50.96,10.79
  Bottom 0.203: U1.1 49.46,11.18 49.85,10.79 v50.96,10.79
  Bottom 0.254: U2.11 v71.12,13.34 | R7.1 v65.41,20.32 v65.41,17.78
SEN3  (via drill 0.25 pad 0.25)
  Top 0.254: v70.96,12.06 69.06,13.97 69.06,14.29 66.99,16.35 66.99,18.89 66.52,19.37 65.09,19.37 64.45,20 64.45,22.17 63.76,22.86 v62.71,22.86
  Bottom 0.254: U2.9 70.48,10.79 70.96,11.27 v70.96,12.06
  Bottom 0.406: U104.3 62.34,23.23 v62.71,22.86 R14.1
SEN3BUF  (via drill 0.25 pad 0.25)
  Top 0.254: v71.91,11.27 71.75,11.11 70.48,11.11 70.01,11.59 70.01,12.06 68.42,13.65 68.42,14.05 66.36,16.11 66.36,18.26 65.88,18.73 64.77,18.73 63.82,19.68 63.82,21.27 63.18,21.91 62.39,21.91 60.96,23.34 55.24,23.34 53.82,21.91 53.82,20.64 53.5,20.32 v52.7,20.32 52.07,20.95 50.32,20.95 49.69,20.32 49.69,16.99 49.21,16.51 49.21,11.11 50.16,10.16 50.16,9.84 v50.48,9.53
  Bottom 0.203: U1.2 49.06,10.95 v50.48,9.53
  Bottom 0.254: R8.1 v52.7,20.32 | U2.8 70.33,9.53 70.64,9.84 70.64,10.16 71.12,10.64 71.75,10.64 71.91,10.79 v71.91,11.27
SEN4  (via drill 0.25 pad 0.25)
  Top 0.254: v35.96,15.88 35.96,16.35 36.83,17.22 36.83,21.59 37.15,21.91 37.62,21.91 38.73,23.02 40.64,23.02 41.43,22.23 v41.75,22.23 | v43.66,22.38 49.53,22.38 v50.01,22.86
  Bottom 0.254: U6.2 v35.96,15.88 | v41.75,22.23 42.55,22.23 42.7,22.38 v43.66,22.38
  Bottom 0.406: U105.3 49.64,23.23 v50.01,22.86 R22.1
SEN4BUF  (via drill 0.25 pad 0.25)
  Top 0.254: v40.01,20.32 40.01,21.43 39.69,21.75 38.42,21.75 37.47,20.8 37.47,16.83 36.99,16.35 36.99,15.16 36.43,14.61 v35.96,14.61 35.96,13.57 36.99,12.54 36.99,12.06 37.62,11.43 40.64,11.43 41.12,10.95 45.09,10.95 45.88,10.16 v45.88,9.53
  Bottom 0.203: U1.5 47.86,10.55 46.83,9.53 v45.88,9.53
  Bottom 0.254: U6.3 v35.96,14.61 | R17.1 v40.01,20.32
SEN5  (via drill 0.25 pad 0.25)
  Top 0.254: v37.31,22.86 36.51,22.86 36.04,22.38 36.04,17.7 34.92,16.59 34.92,13.65 35.96,12.62 v35.96,12.06
  Bottom 0.254: U6.5 v35.96,12.06
  Bottom 0.406: U106.3 36.94,23.23 v37.31,22.86 R26.1
SEN5BUF  (via drill 0.25 pad 0.25)
  Top 0.254: v27.3,20.32 30.8,20.32 31.11,20 31.11,18.89 31.59,18.41 31.59,14.29 32.23,13.65 33.97,13.65 34.92,12.7 34.92,11.75 35.4,11.27 v35.4,10.79 40.01,10.79 40.8,10 v44.77,10
  Bottom 0.203: U1.6 47.46,10.95 46.83,10.32 45.09,10.32 v44.77,10
  Bottom 0.254: U6.6 v35.4,10.79 | v27.3,20.32 R18.1
SEN6  (via drill 0.25 pad 0.25)
  Top 0.254: v24.61,22.86 27.3,22.86 27.62,22.54 29.21,22.54 30,23.34 31.43,23.34 32.54,22.23 32.54,19.37 33.5,18.41 33.5,16.51 32.62,15.64 v32.62,14.61
  Bottom 0.254: U6.12 v32.62,14.61
  Bottom 0.406: U107.3 24.24,23.23 v24.61,22.86 R27.1
SEN6BUF  (via drill 0.25 pad 0.25)
  Top 0.254: v14.61,21.27 14.45,21.43 14.45,22.07 14.92,22.54 16.35,22.54 16.67,22.86 23.34,22.86 24.29,21.91 25.88,21.91 26.35,21.43 26.35,20 27.15,19.21 29.84,19.21 30.96,18.1 30.96,14.37 30.4,13.81 v30.4,13.34 30.72,13.02 33.66,13.02 34.21,12.46 34.21,10.72 35.08,9.84 35.72,9.84 36.04,10.16 39.53,10.16 40.64,9.05 45.09,9.05 45.56,8.57 46.35,8.57 46.99,9.21 46.99,9.84 46.67,10.16 46.67,10.64 v46.2,11.11
  Bottom 0.203: U1.7 47.06,11.18 46.99,11.11 v46.2,11.11
  Bottom 0.254: U6.11 v30.4,13.34 | v14.61,21.27 R19.1
SEN7  (via drill 0.25 pad 0.25)
  Top 0.254: v30.4,10.79 30.4,11.99 29.45,12.94 29.45,13.89 30.32,14.76 30.32,17.78 29.53,18.57 26.83,18.57 25.72,19.68 25.72,20.95 25.4,21.27 23.97,21.27 23.02,22.23 16.91,22.23 15,20.32 14.29,20.32 13.65,20.95 13.65,22.33 R28.1 v11.91,22.86
  Bottom 0.254: U6.9 v30.4,10.79
  Bottom 0.406: U108.3 11.54,23.23 v11.91,22.86 R28.1
SEN7BUF  (via drill 0.25 pad 0.25)
  Top 0.254: 3.97,21.91 v3.81,21.75 4.45,22.38 10.95,22.38 11.43,21.91 12.7,21.91 12.86,21.75 12.86,20.8 13.97,19.68 15.24,19.68 17.07,21.51 17.86,21.51 20.8,18.57 22.38,18.57 23.18,19.37 25.08,19.37 26.51,17.94 29.21,17.94 29.69,17.46 29.69,15.08 28.81,14.21 28.81,12.62 29.37,12.06 29.37,10 29.84,9.53 v30,9.53 30.96,9.53 31.27,9.21 36.04,9.21 36.35,9.53 39.21,9.53 40.32,8.41 44.77,8.41 45.24,7.94 46.67,7.94 47.62,8.89 47.62,10.16 47.31,10.48 47.31,11.27 46.51,12.06 45.4,12.06 v45.24,11.91
  Bottom 0.203: U1.8 45.63,12.77 45.4,12.54 45.4,12.06 v45.24,11.91
  Bottom 0.254: U6.8 v30,9.53 | R20.1 2.96,21.38 3.33,21.75 v3.81,21.75
VCC  (via drill 0.25 pad 0.25)
  Top 0.406: 101.6,13.97 JP1.3 JP1.4 | 101.6,13.97 103.98,13.97 105.25,15.24 105.25,25.4 104.14,26.51 89.53,26.51 89.06,26.04 82.55,26.04 82.07,26.51 50.96,26.51 50.48,26.04 41.91,26.04 41.43,26.51 24.29,26.51 23.81,26.04 14.76,26.04 14.29,26.51 2.54,26.51 1.43,25.4 1.43,14.61 1.59,14.45 v1.59,13.49 v1.59,12.54 | v86.68,7.46 v88.58,7.46 | v15.24,10.95 13.65,12.54 v5.4,12.54 v4.45,12.54 | v88.58,7.46 93.19,7.46 94.77,9.05 100.49,9.05 101.6,10.16 101.6,13.97 | v88.58,7.46 88.58,14.45 88.12,14.9 SJ5.1
  Bottom 0.406: U3.1 v88.58,7.46 | U3.3 v86.68,7.46 | JP1.4 JP1.3 | U5.3 15.96,11.68 v15.24,10.95 15.08,10.95 | C8.A 15.08,10.95 | C2.1 14.76,9.05 15.24,9.53 15.24,10.79 15.08,10.95 | v1.59,12.54 v4.45,12.54
~RESET
  Bottom 0.203: U1.23 50.97,14.77 51.12,14.92 51.12,16.35 51.33,16.57 R31.2
  Bottom 0.254: C6.1 R31.2
(copper drawn outside any net)
  shapes: Top circle x1

### Text on the board
Top: All LED holes 0.09 inch diameter
Bottom: v10
tPlace: IR | BRIGHTER | (-) | 0 | (+) | b7 | b6 | b5 | b4 | b3 | b2 | b1 | b0 | I2C PULL | IR PWR | 3.3V | SDA/A4 | A5/SCL | 5V | 5V | 5V | GND | GND | INT | RedBot Sensor Bar
bPlace: 1 | 1 | A1 | A0 | I2C | 0 | 0 | A1 | 0 | 0 | A0 | 0x3E | 0 | 1 | 0x3F | C ADDR | 1 | 0 | 0x70 | 1 | 1 | 0x71 | 2 | I
Measures: Dimentions from axis | Dimensions from origin | mils | Units in inches unless specified
tDocu: Marshall Taylor